# Altium project HHOLowCost.PRJPCB
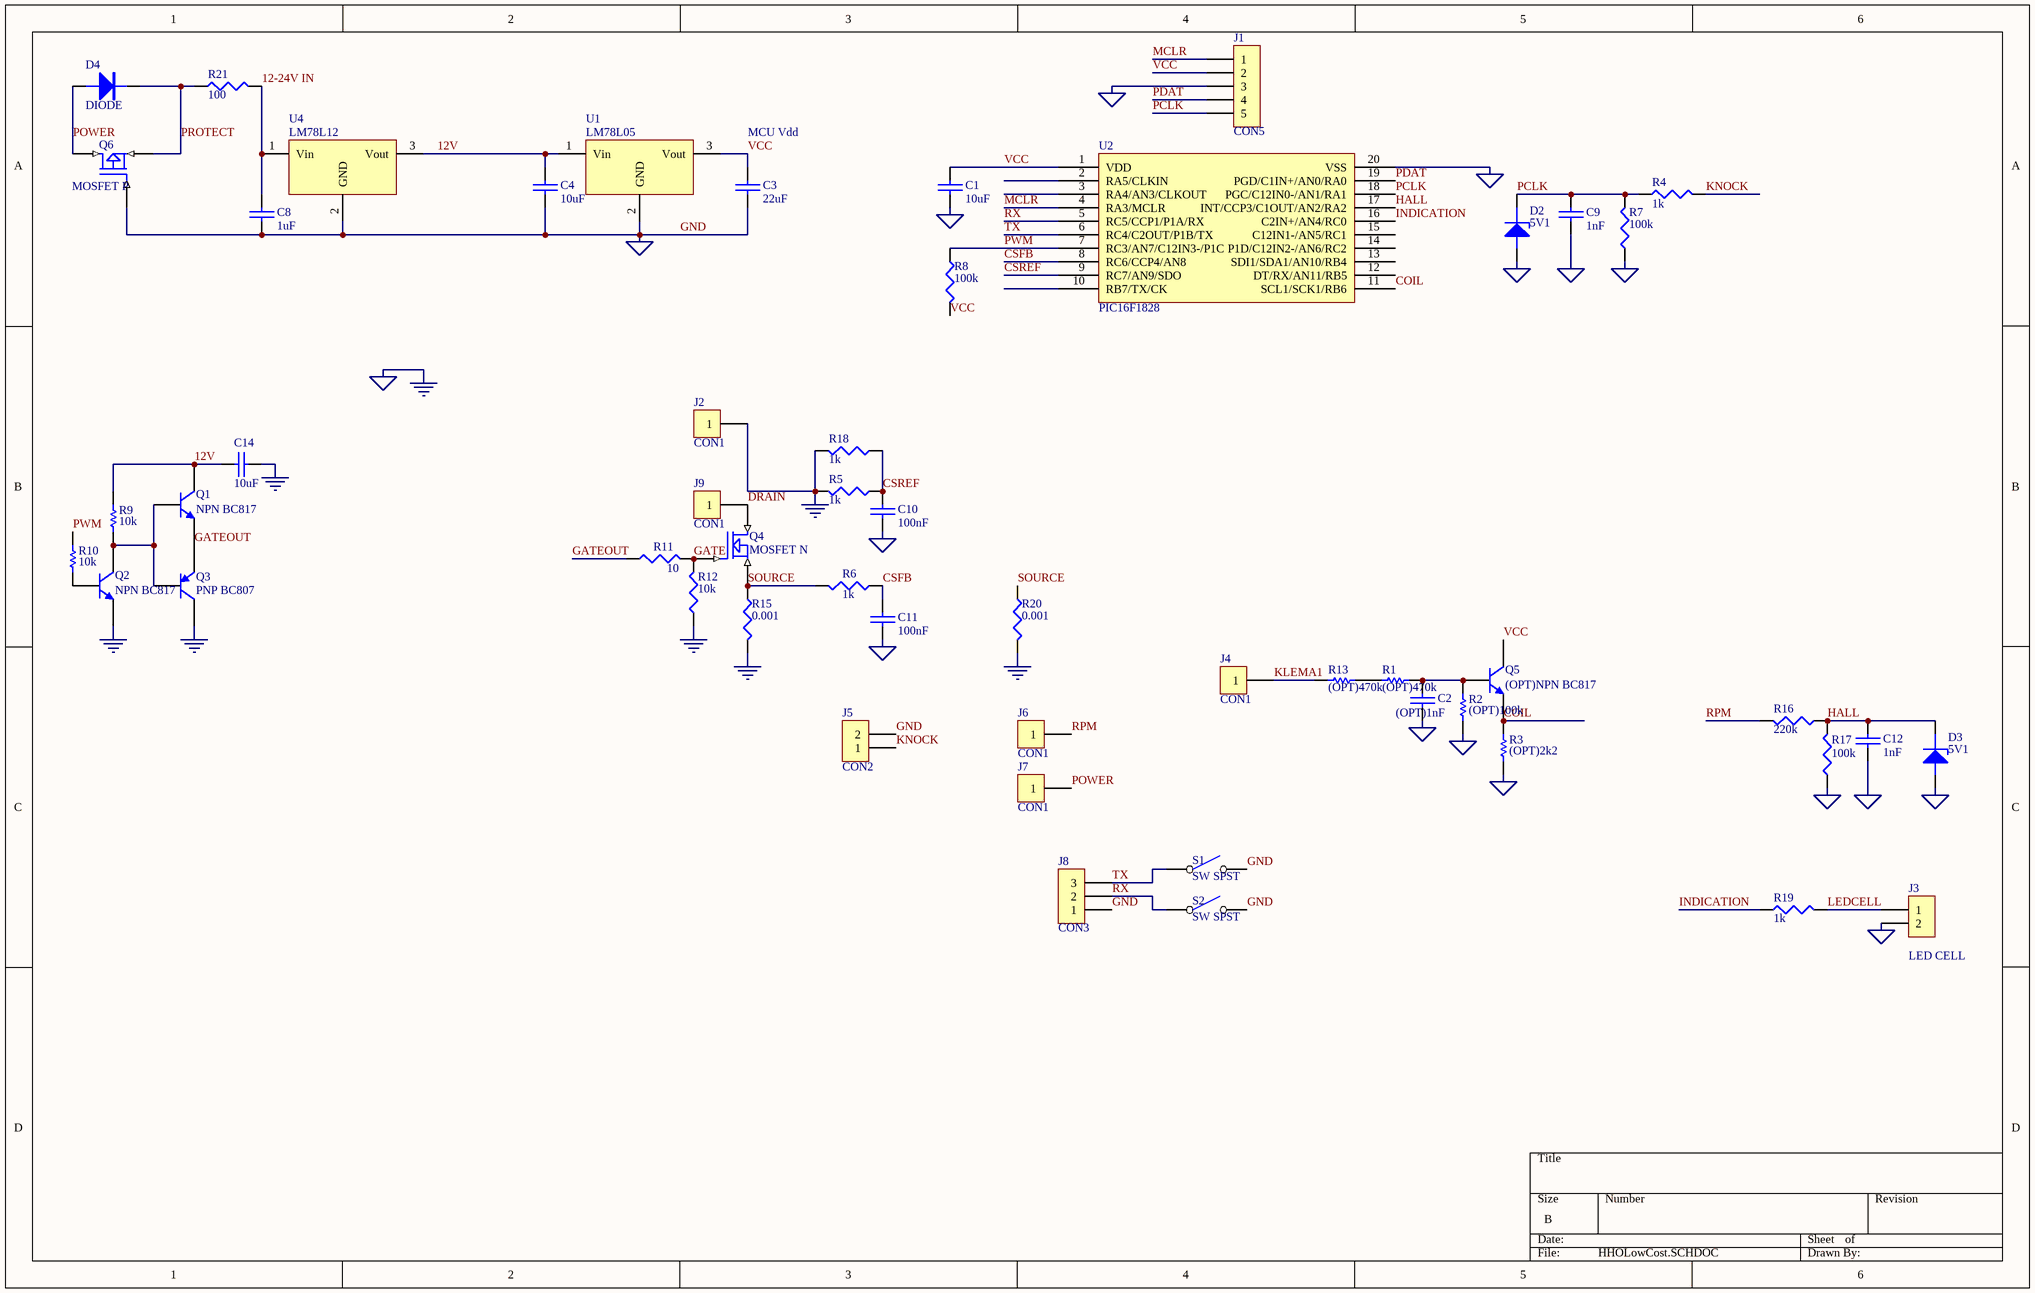
[diagram p0: HHOLowCost.SCHDOC]
1 sheet, 53 parts. Net scope: global (net labels, ports and power ports of the same name join across sheets).
Board file: HHOLowCost.PcbDoc

## Sheet HHOLowCost.SCHDOC
size B

### Parts
C1  10uF  [0805]
C2  (OPT)1nF  [0603 CAP]
C3  22uF  [0805]
C4  10uF  [0805]
C8  1uF  [0805]
C9  1nF  [0603 CAP]
C10  100nF  [0603 CAP]
C11  100nF  [0603 CAP]
C12  1nF  [0603 CAP]
C14  10uF  [0805]
D2  5V1  [SOT-23 2 PIN]
D3  5V1  [SOT-23 2 PIN]
D4  DIODE  [SMA + SOT23]
J1  CON5  [SIP5 - PGM]
J2  CON1  [HD 11mm 1P]
J3  LED CELL  [SIP2]
J4  CON1  [HD-351 1P]
J5  CON2  [HD-351 2P]
J6  CON1  [HD-351 1P]
J7  CON1  [HD-351 1P]
J8  CON3  [SIP3]
J9  CON1  [HD 11mm 1P]
Q1  NPN BC817  [SOT-23]
Q2  NPN BC817  [SOT-23]
Q3  PNP BC807  [sot-23]
Q4  MOSFET N  [D2-Pack - 7]
Q5  (OPT)NPN BC817  [SOT-23]
Q6  MOSFET P  [SOT-23]
R1  (OPT)470k  [0805]
R2  (OPT)100k  [0603]
R3  (OPT)2k2  [0603]
R4  1k  [0603 RES]
R5  1k  [0603 RES]
R6  1k  [0603 RES]
R7  100k  [0603 RES]
R8  100k  [0603 RES]
R9  10k  [0603]
R10  10k  [0603]
R11  10  [0603 RES]
R12  10k  [0603 RES]
R13  (OPT)470k  [0805]
R15  0.001  [2512]
R16  220k  [0603 RES]
R17  100k  [0603 RES]
R18  1k  [0603 RES]
R19  1k  [0603 RES]
R20  0.001  [1225]
R21  100  [0805]
S1  SW SPST  [TactBut]
S2  SW SPST  [TactBut]
U1  LM78L05  [SO-8 VOLTREG]
U2  PIC16F1828  [SOIC20WIDE]
U4  LM78L12  [SO-8 VOLTREG]

### Nets
GND: C1.2 C2.2 C3.2 C4.2 C8.2 C9.2 C10.2 C11.2 C12.2 C14.1 D2.1(A) D3.1(A) J1.3 J2.1 J3.2 J5.2 J8.1 Q2.3(E) Q3.2(C) Q6.1(G) R2.2 R3.2 R5.2 R7.1 R12.1 R15.2 R17.1 R18.2 R20.2 S1.2(NO) S2.2(NO) U1.2(GND) U2.20(VSS) U4.2(GND)  [also labelled PGND, SGND]
12-24V IN: C8.1 R21.2 U4.1(Vin)
12V: C4.1 C14.2 Q1.2(C) R9.1 U1.1(Vin) U4.3(Vout)
COIL: Q5.3(E) R3.1 U2.11(SCL1/SCK1/RB6)
CSFB: C11.1 R6.1 U2.8(RC6/CCP4/AN8)
CSREF: C10.1 R5.1 R18.1 U2.9(RC7/AN9/SDO)
DRAIN: J9.1 Q4.2(D)
GATE: Q4.1(G) R11.2 R12.2
GATEOUT: Q1.3(E) Q3.3(E) R11.1
HALL: C12.1 D3.2(K) R16.1 R17.2 U2.17(INT/CCP3/C1OUT/AN2/RA2)
INDICATION: R19.1 U2.16(C2IN+/AN4/RC0)
KLEMA1: J4.1 R13.2
KNOCK: J5.1 R4.2
LEDCELL: J3.1 R19.2
MCLR: J1.1 U2.4(RA3/MCLR)
PCLK: C9.1 D2.2(K) J1.5 R4.1 R7.2 U2.18(PGC/C12IN0-/AN1/RA1)
PDAT: J1.4 U2.19(PGD/C1IN+/AN0/RA0)
POWER: D4.A J7.1 Q6.2(D)
PROTECT: D4.K Q6.3(S) R21.1
PWM: R8.1 R10.1 U2.7(RC3/AN7/C12IN3-/P1C)
RPM: J6.1 R16.2
RX: J8.2 S2.1(COMMON) U2.5(RC5/CCP1/P1A/RX)
SOURCE: Q4.3(S) R6.2 R15.1 R20.1
TX: J8.3 S1.1(COMMON) U2.6(RC4/C2OUT/P1B/TX)
VCC: C1.1 C3.1 J1.2 Q5.2(C) R8.2 U1.3(Vout) U2.1(VDD)
NetC2_1: C2.1 Q5.1(B) R1.1 R2.1
NetQ1_1: Q1.1(B) Q2.2(C) Q3.1(B) R9.2
NetQ2_1: Q2.1(B) R10.2
NetR1_2: R1.2 R13.1

Not connected (* = marked no-connect by the designer): U2 2(RA5/CLKIN) 3(RA4/AN3/CLKOUT) 10(RB7/TX/CK) 12(DT/RX/AN11/RB5) 13(SDI1/SDA1/AN10/RB4) 14(P1D/C12IN2-/AN6/RC2) 15(C12IN1-/AN5/RC1)

### Notes on the sheet
- MCU Vdd

### Library data of the parts
C1-C4 C8-C12 C14 = CAP: Capacitor
D2 D3 = ZENER1: Zener Diode
J1 = CON5: Connector
J2 J4 J6 J7 J9 = CON1: Connector
J3 J5 = CON2: Connector
J8 = CON3: Connector
Q1 Q2 Q5 = NPN: NPN Bipolar Transistor; Manufacturer: Generic Components; Class: Discrete; SubClass: BJT - Low Power; Published: 08/06/2000; Publisher: Altium Hobart Technology Centre
Q3 = PNP: PNP Bipolar Transistor; Manufacturer: Generic Components; Class: Discrete; SubClass: BJT - Low Power; Published: 08/06/2000; Publisher: Altium Hobart Technology Centre
R1-R3 R9 R10 R13 = Res1: Resistor; Manufacturer: Generic Components; Class: Passive; Value: 4k7; Published: 08/06/2000; Publisher: Altium Hobart Technology Centre; SubClass: Resistor
R4-R8 R11 R12 R15-R21 = RES1
U1 U4 = VOLTREG
U2 = PIC16F1828: Microchip Microcontroller